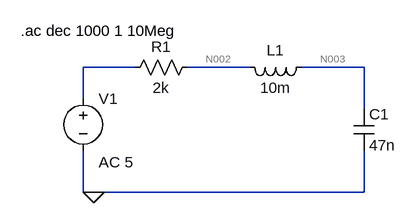
[diagram p0: schematic circuit4b.asc]
circuit4b.asc, the LTspice schematic file:
Version 4.1
SHEET 1 880 680
WIRE 64 112 -16 112
WIRE 240 112 144 112
WIRE 416 112 320 112
WIRE -16 160 -16 112
WIRE 416 176 416 112
WIRE -16 304 -16 240
WIRE 0 304 -16 304
WIRE 416 304 416 240
WIRE 416 304 0 304
FLAG 0 304 0
SYMBOL voltage -16 144 R0
WINDOW 123 24 114 Left 2
WINDOW 39 0 0 Left 0
SYMATTR InstName V1
SYMATTR Value ""
SYMATTR Value2 AC 5
SYMBOL res 160 96 R90
WINDOW 0 0 56 VBottom 2
WINDOW 3 32 56 VTop 2
SYMATTR InstName R1
SYMATTR Value 2k
SYMBOL ind 336 96 R90
WINDOW 0 5 56 VBottom 2
WINDOW 3 32 56 VTop 2
SYMATTR InstName L1
SYMATTR Value 10m
SYMBOL cap 400 176 R0
SYMATTR InstName C1
SYMATTR Value 47n
TEXT -112 56 Left 2 !.ac dec 1000 1 10Meg

The netlist it stands for:
* circuit4b.asc
V1 N001 0 AC 5
R1 N002 N001 2k
L1 N003 N002 10m
C1 N003 0 47n
.ac dec 1000 1 10Meg
.backanno
.end

* Results of the author's LTspice run, read from the files saved beside the schematic
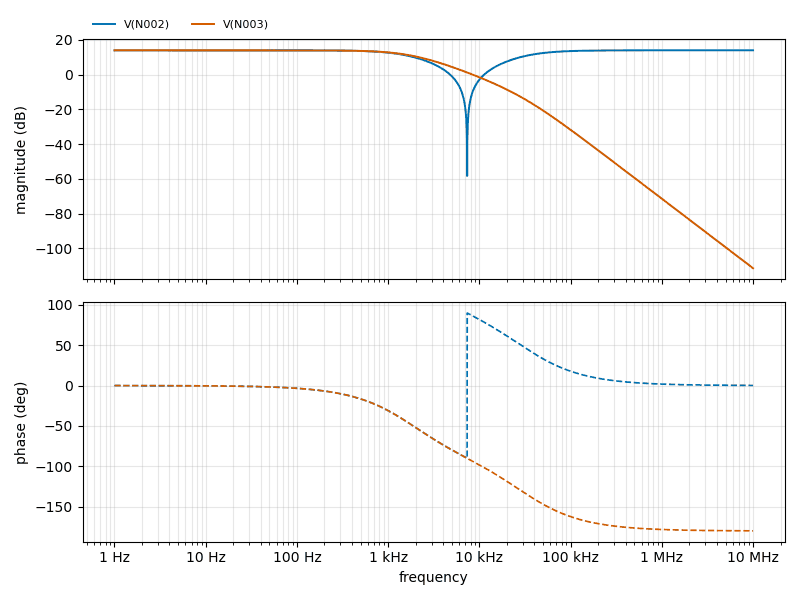
[diagram p1: AC Analysis of circuit4b.asc, plotted from the saved traces]
* AC Analysis, 1 run:
*   V(N002): 13.98 dB at 1 Hz, 13.98 dB at 10 MHz, peak 13.98 dB at 1 Hz, 3 dB below the peak at 1.612 kHz
*   V(N003): 13.98 dB at 1 Hz, -111.39 dB at 10 MHz, peak 13.98 dB at 1 Hz, 3 dB below the peak at 1.788 kHz